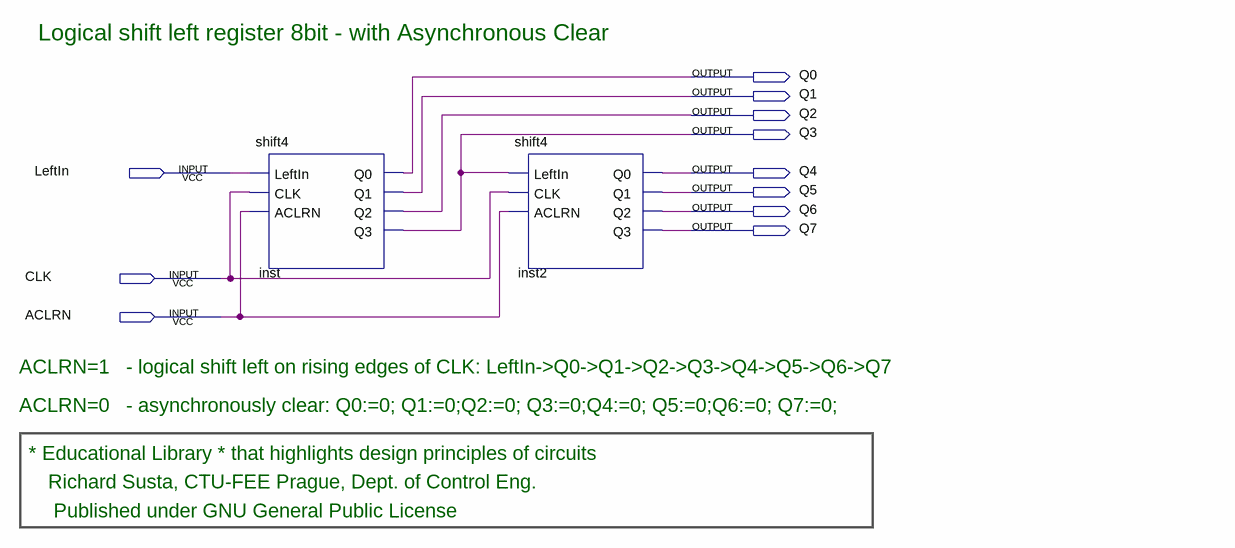
[diagram p0: schematic sheet]
// Quartus schematic shift8.bdf as structural Verilog: 2 symbols, 11 pins
module shift8 (
  input  LeftIn,
  input  CLK,
  input  ACLRN,
  output Q0,
  output Q1,
  output Q2,
  output Q3,
  output Q4,
  output Q5,
  output Q6,
  output Q7
);

  shift4 inst (.LeftIn(LeftIn), .CLK(CLK), .ACLRN(ACLRN), .Q0(Q0), .Q1(Q1), .Q2(Q2), .Q3(Q3));
  shift4 inst2 (.LeftIn(Q3), .CLK(CLK), .ACLRN(ACLRN), .Q0(Q4), .Q1(Q5), .Q2(Q6), .Q3(Q7));

  // Notes on the sheet:
  //   Logical shift left register 8bit - with Asynchronous Clear
  //   ACLRN=1   - logical shift left on rising edges of CLK: LeftIn->Q0->Q1->Q2->Q3->Q4->Q5->Q6->Q7
  //   ACLRN=0   - asynchronously clear: Q0:=0; Q1:=0;Q2:=0; Q3:=0;Q4:=0; Q5:=0;Q6:=0; Q7:=0;
  //   * Educational Library * that highlights design principles of circuits
  //   Richard Susta, CTU-FEE Prague, Dept. of Control Eng. 
  //    Published under GNU General Public License
endmodule
